# Altium project PCB_Project.PrjPcb
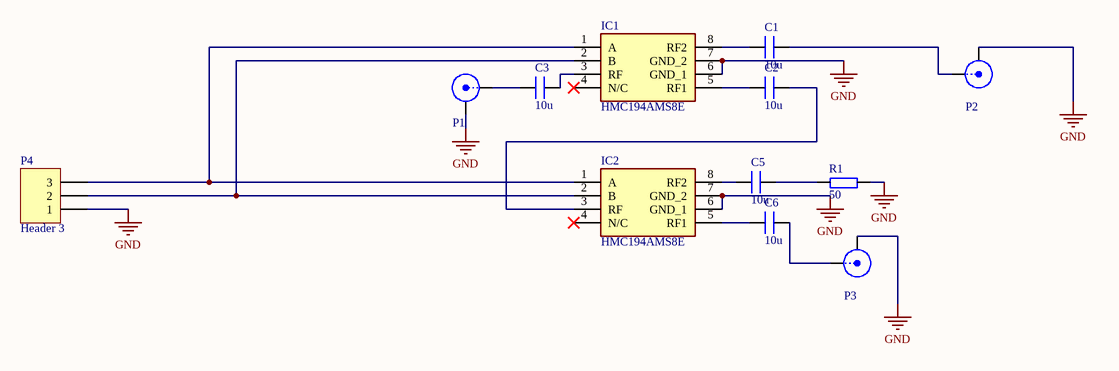
[diagram p0: D-HMC194.SchDoc]
1 sheet, 12 parts. Net scope: global (net labels, ports and power ports of the same name join across sheets).
Board file: D-HMC194.PcbDoc

## Sheet D-HMC194.SchDoc
size A4

### Parts
C1  10u  [0402]
C2  10u  [0402]
C3  10u  [0402]
C5  10u  [0402]
C6  10u  [0402]
IC1  HMC194AMS8E  [SOP65P488X110-8N]
IC2  HMC194AMS8E  [SOP65P488X110-8N]
P1  SMA  [SMA]  (value not drawn)
P2  SMA  [SMA]  (value not drawn)
P3  SMA  [SMA]  (value not drawn)
P4  Header 3  [HDR1X3]
R1  50  [0603R]

### Nets
GND: IC1.6(GND_1) IC1.7(GND_2) IC2.6(GND_1) IC2.7(GND_2) P1.2(Y) P2.2(Y) P3.2(Y) P4.1 R1.2
NetC1_1: C1.1 IC1.8(RF2)
NetC1_2: C1.2 P2.1(X)
NetC2_1: C2.1 IC1.5(RF1)
NetC2_2: C2.2 IC2.3(RF)
NetC3_1: C3.1 P1.1(X)
NetC3_2: C3.2 IC1.3(RF)
NetC5_1: C5.1 IC2.8(RF2)
NetC5_2: C5.2 R1.1
NetC6_1: C6.1 IC2.5(RF1)
NetC6_2: C6.2 P3.1(X)
NetIC1_1: IC1.1(A) IC2.1(A) P4.3
NetIC1_2: IC1.2(B) IC2.2(B) P4.2

Not connected (* = marked no-connect by the designer): IC1 4(N/C)*; IC2 4(N/C)*

### Library data of the parts
C1-C3 C5 C6 = C: Capacitor
IC1 IC2 = HMC194AMS8E: Integrated Circuit; Manufacturer_Name: Analog Devices; Datasheet Link: https://www.mouser.in/datasheet/2/609/hmc194a-1503833.pdf; Height: 1.1mm; Manufacturer_Part_Number: HMC194AMS8E; Mouser Part Number: 584-HMC194AMS8E; Mouser Price/Stock: https://www.mouser.co.uk/ProductDetail/Analog-Devices/HMC194AMS8E?qs=pceeu5JH%2FH9MSXBwBTVYMg%3D%3D; Arrow Part Number: HMC194AMS8E; Arrow Price/Stock: https://www.arrow.com/en/products/hmc194ams8e/analog-devices
P1-P3 = SMA: SMA Connector
P4 = Header 3: Header, 3-Pin; LatestRevisionDate: 17-Jul-2002; LatestRevisionNote: Re-released for DXP Platform.; Publisher: Altium Limited
R1 = Resistor